# Altium schematic sheet INTERFACE_PWR_LS_HS.SchDoc
size A4
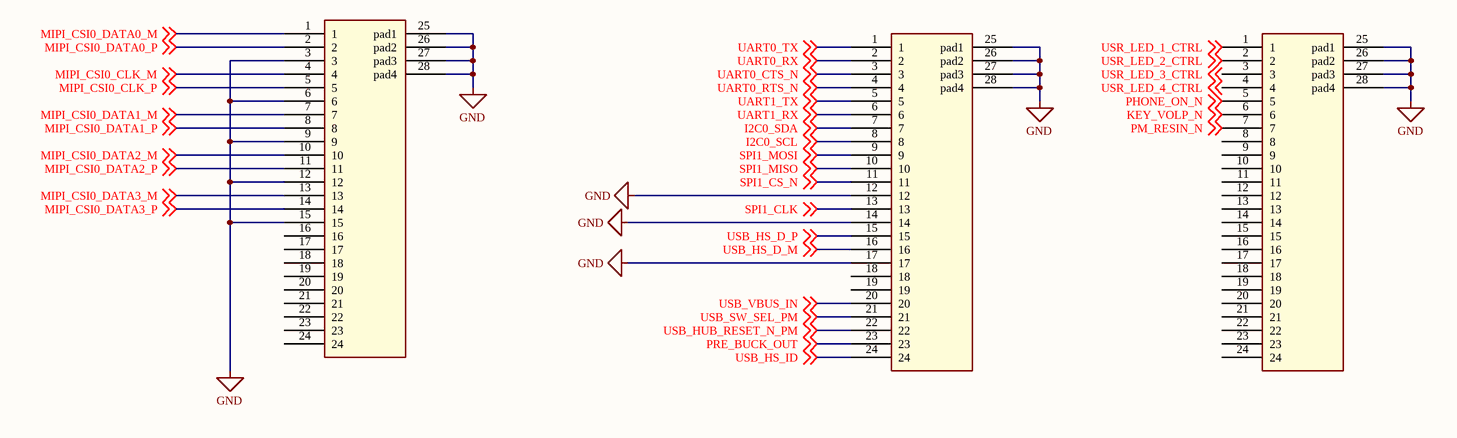
[diagram p0: INTERFACE_PWR_LS_HS.SchDoc]

## Parts
CN0  CON24_0  [c0402]  (value not drawn)
CN1  CON24_0  [c0402]  (value not drawn)
CN2  CON24_0  [c0402]  (value not drawn)

## Nets
GND: CN0.3 CN0.6 CN0.9 CN0.12 CN0.15 CN0.25(pad1) CN0.26(pad2) CN0.27(pad3) CN0.28(pad4) CN1.12 CN1.14 CN1.17 CN1.25(pad1) CN1.26(pad2) CN1.27(pad3) CN1.28(pad4) CN2.25(pad1) CN2.26(pad2) CN2.27(pad3) CN2.28(pad4)
I2C0_SCL: CN1.8 ; off-sheet I2C0_SCL
I2C0_SDA: CN1.7 ; off-sheet I2C0_SDA
KEY_VOLP_N: CN2.6 ; off-sheet KEY_VOLP_N
MIPI_CSI0_CLK_M: CN0.4 ; off-sheet MIPI_CSI0_CLK_M
MIPI_CSI0_CLK_P: CN0.5 ; off-sheet MIPI_CSI0_CLK_P
MIPI_CSI0_DATA0_M: CN0.1 ; off-sheet MIPI_CSI0_DATA0_M
MIPI_CSI0_DATA0_P: CN0.2 ; off-sheet MIPI_CSI0_DATA0_P
MIPI_CSI0_DATA1_M: CN0.7 ; off-sheet MIPI_CSI0_DATA1_M
MIPI_CSI0_DATA1_P: CN0.8 ; off-sheet MIPI_CSI0_DATA1_P
MIPI_CSI0_DATA2_M: CN0.10 ; off-sheet MIPI_CSI0_DATA2_M
MIPI_CSI0_DATA2_P: CN0.11 ; off-sheet MIPI_CSI0_DATA2_P
MIPI_CSI0_DATA3_M: CN0.13 ; off-sheet MIPI_CSI0_DATA3_M
MIPI_CSI0_DATA3_P: CN0.14 ; off-sheet MIPI_CSI0_DATA3_P
PHONE_ON_N: CN2.5 ; off-sheet PHONE_ON_N
PM_RESIN_N: CN2.7 ; off-sheet PM_RESIN_N
PRE_BUCK_OUT: CN1.23 ; off-sheet PRE_BUCK_OUT
SPI1_CLK: CN1.13 ; off-sheet SPI1_CLK
SPI1_CS_N: CN1.11 ; off-sheet SPI1_CS_N
SPI1_MISO: CN1.10 ; off-sheet SPI1_MISO
SPI1_MOSI: CN1.9 ; off-sheet SPI1_MOSI
UART0_CTS_N: CN1.3 ; off-sheet UART0_CTS_N
UART0_RTS_N: CN1.4 ; off-sheet UART0_RTS_N
UART0_RX: CN1.2 ; off-sheet UART0_RX
UART0_TX: CN1.1 ; off-sheet UART0_TX
UART1_RX: CN1.6 ; off-sheet UART1_RX
UART1_TX: CN1.5 ; off-sheet UART1_TX
USB_HS_D_M: CN1.16 ; off-sheet USB_HS_D_M
USB_HS_D_P: CN1.15 ; off-sheet USB_HS_D_P
USB_HS_ID: CN1.24 ; off-sheet USB_HS_ID
USB_HUB_RESET_N_PM: CN1.22 ; off-sheet USB_HUB_RESET_N_PM
USB_SW_SEL_PM: CN1.21 ; off-sheet USB_SW_SEL_PM
USB_VBUS_IN: CN1.20 ; off-sheet USB_VBUS_IN
USR_LED_1_CTRL: CN2.1 ; off-sheet USR_LED_1_CTRL
USR_LED_2_CTRL: CN2.2 ; off-sheet USR_LED_2_CTRL
USR_LED_3_CTRL: CN2.3 ; off-sheet USR_LED_3_CTRL
USR_LED_4_CTRL: CN2.4 ; off-sheet USR_LED_4_CTRL

Not connected (* = marked no-connect by the designer): CN0 16 17 18 19 20 21 22 23 24; CN1 18 19; CN2 8 9 10 11 12 13 14 15 16 17 18 19 20 21 22 23 24